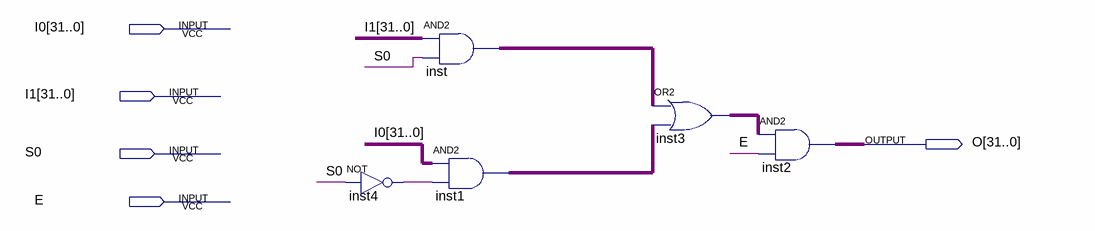
[diagram p0: schematic sheet]
// Quartus schematic MUX2_32.bdf as structural Verilog: 5 symbols, 5 pins
module MUX2_32 (
  input  [31:0] I0,
  input  [31:0] I1,
  input  S0,
  input  E,
  output [31:0] O
);

  wire inst4_out;
  wire [31:0] inst1_out, inst3_out, inst_out;

  not inst4 (inst4_out, S0);
  assign inst_out = I1 & {32{S0}};  // AND2 inst, 32 bits wide
  assign inst1_out = I0 & {32{inst4_out}};  // AND2 inst1, 32 bits wide
  assign inst3_out = inst_out | inst1_out;  // OR2 inst3, 32 bits wide
  assign O = inst3_out & {32{E}};  // AND2 inst2, 32 bits wide
endmodule
